# Altium schematic sheet Power_Supply.SchDoc: Power Supply
size A3; Organization: ORGANIZATION; Address1: ADDRESS 1; Address2: ADDRESS 2; Address3: ADDRESS 3; Address4: ADDRESS 4; Revision: 0.0; SheetNumber: 12; SheetTotal: 19; ENG_APP_DATE: --/--/--; DSN_APP_DATE: --/--/--; CHK_APP_DATE: --/--/--
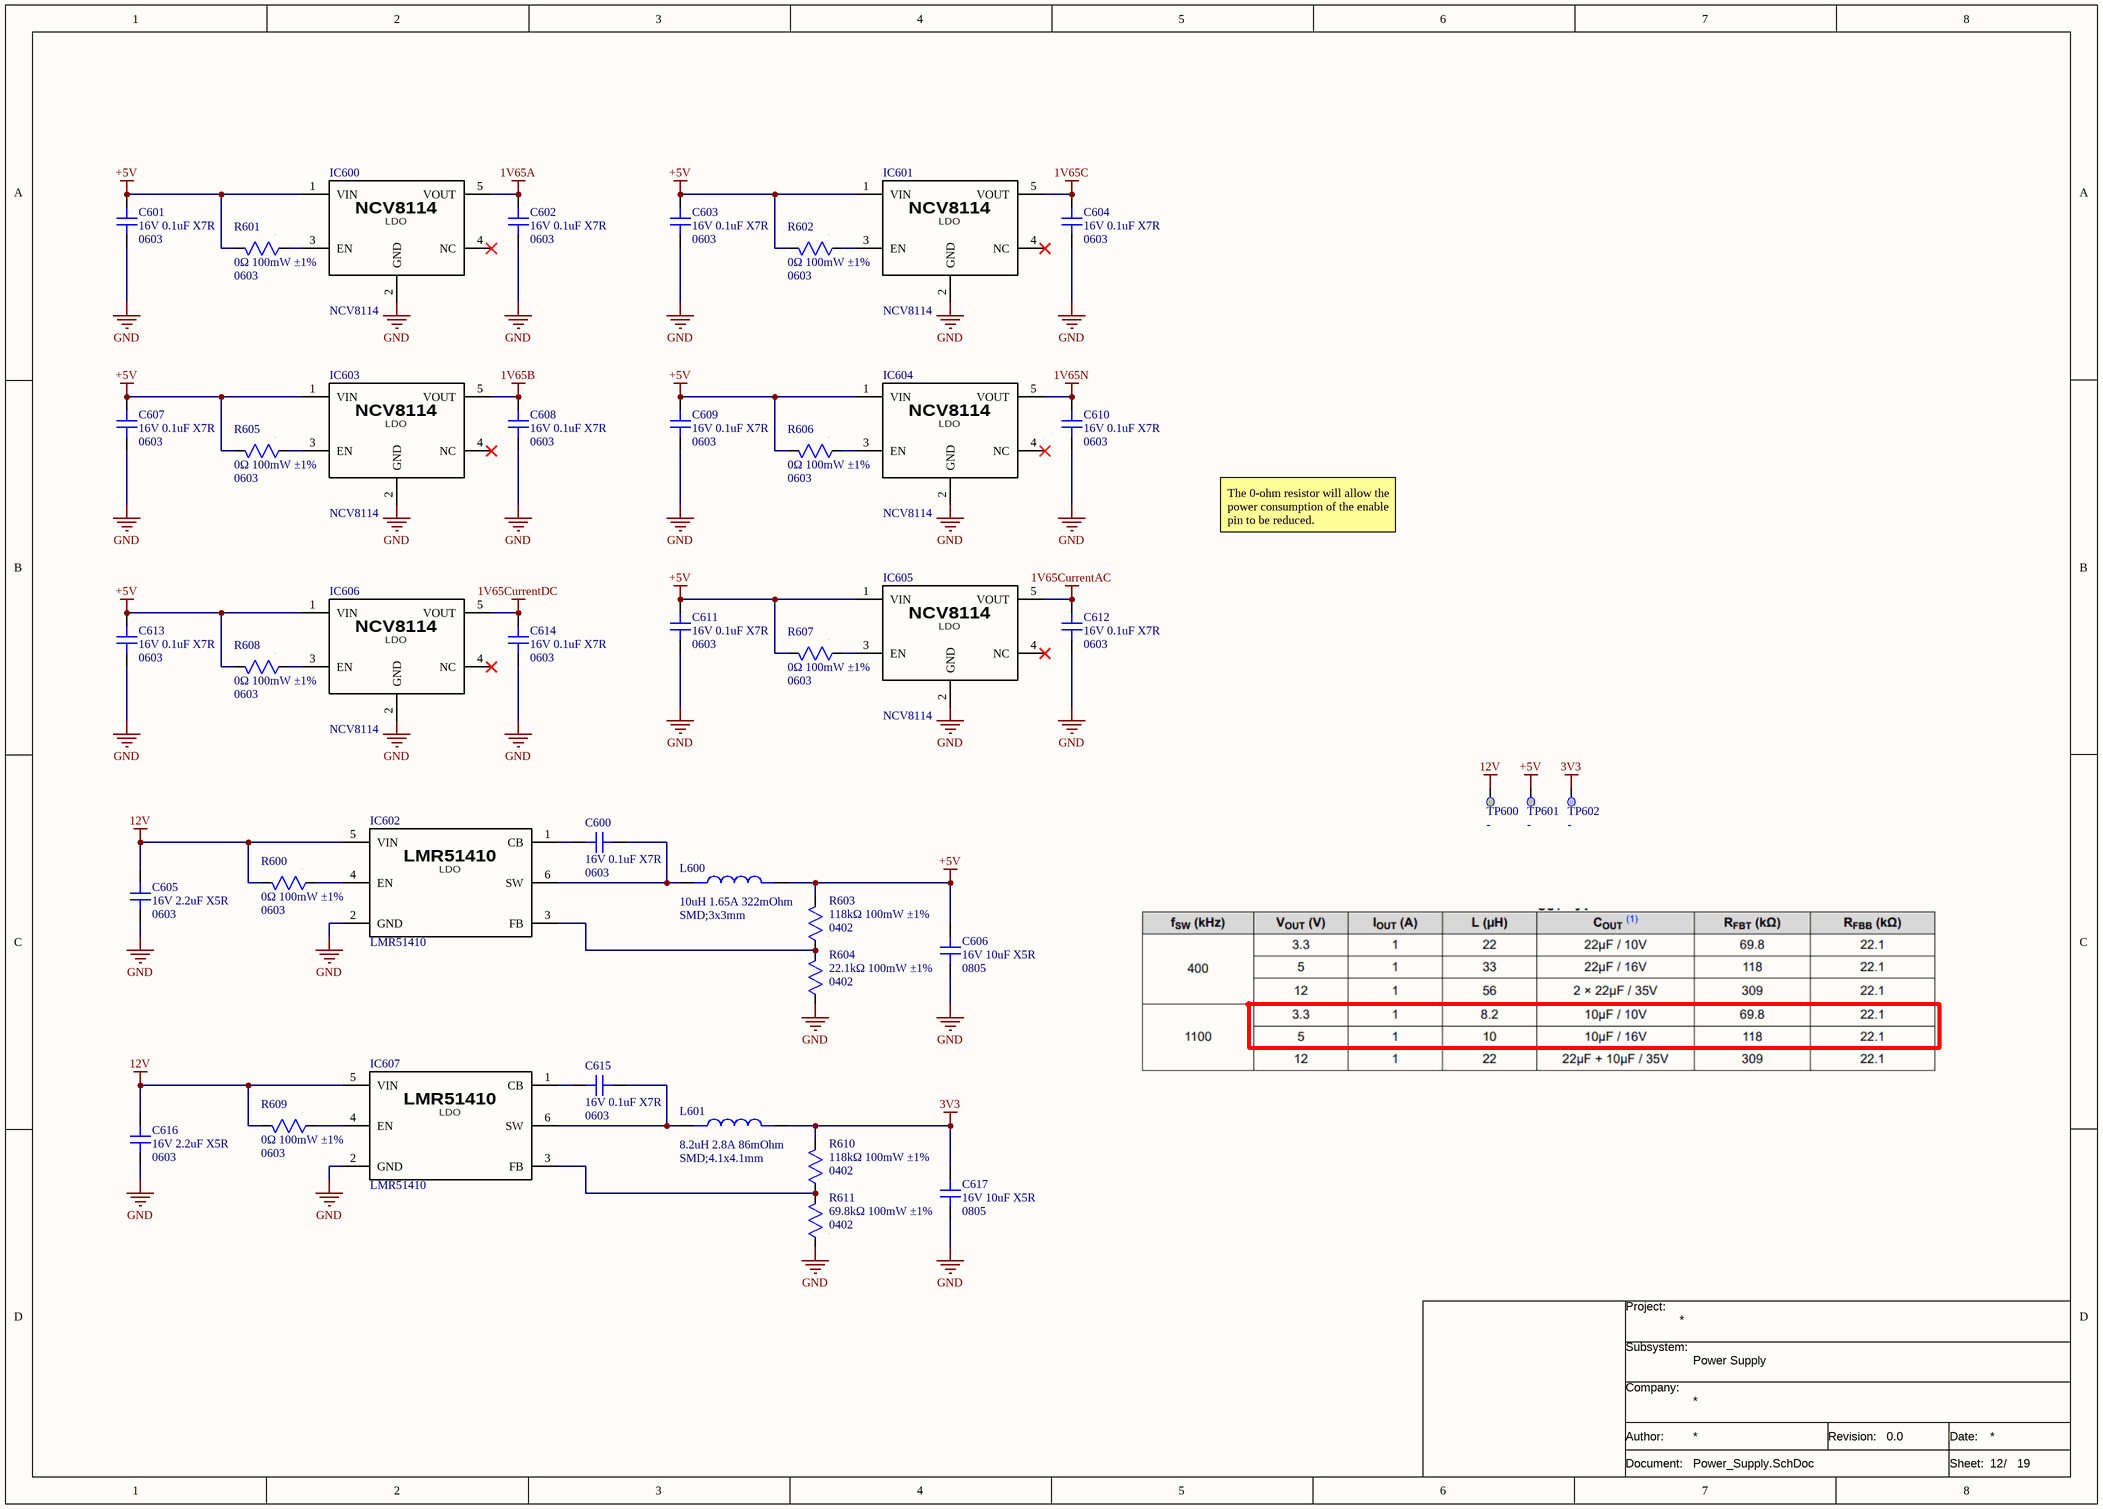
[diagram p0: Power_Supply.SchDoc]

## Parts
C600  value 16V 0.1uF X7R  Package: 0603  [CAP SMD 0603]  (hidden comment: CAP non polarized)
C601  value 16V 0.1uF X7R  Package: 0603  [CAP SMD 0603]  (hidden comment: CAP non polarized)
C602  value 16V 0.1uF X7R  Package: 0603  [CAP SMD 0603]  (hidden comment: CAP non polarized)
C603  value 16V 0.1uF X7R  Package: 0603  [CAP SMD 0603]  (hidden comment: CAP non polarized)
C604  value 16V 0.1uF X7R  Package: 0603  [CAP SMD 0603]  (hidden comment: CAP non polarized)
C605  value 16V 2.2uF X5R  Package: 0603  [CAP SMD 0603]  (hidden comment: CAP non polarized)
C606  value 16V 10uF X5R  Package: 0805  [CAP SMD 0805]  (hidden comment: CAP non polarized)
C607  value 16V 0.1uF X7R  Package: 0603  [CAP SMD 0603]  (hidden comment: CAP non polarized)
C608  value 16V 0.1uF X7R  Package: 0603  [CAP SMD 0603]  (hidden comment: CAP non polarized)
C609  value 16V 0.1uF X7R  Package: 0603  [CAP SMD 0603]  (hidden comment: CAP non polarized)
C610  value 16V 0.1uF X7R  Package: 0603  [CAP SMD 0603]  (hidden comment: CAP non polarized)
C611  value 16V 0.1uF X7R  Package: 0603  [CAP SMD 0603]  (hidden comment: CAP non polarized)
C612  value 16V 0.1uF X7R  Package: 0603  [CAP SMD 0603]  (hidden comment: CAP non polarized)
C613  value 16V 0.1uF X7R  Package: 0603  [CAP SMD 0603]  (hidden comment: CAP non polarized)
C614  value 16V 0.1uF X7R  Package: 0603  [CAP SMD 0603]  (hidden comment: CAP non polarized)
C615  value 16V 0.1uF X7R  Package: 0603  [CAP SMD 0603]  (hidden comment: CAP non polarized)
C616  value 16V 2.2uF X5R  Package: 0603  [CAP SMD 0603]  (hidden comment: CAP non polarized)
C617  value 16V 10uF X5R  Package: 0805  [CAP SMD 0805]  (hidden comment: CAP non polarized)
IC600  NCV8114  [SOT-23-5]
IC601  NCV8114  [SOT-23-5]
IC602  LMR51410  [SOT-23-6]
IC603  NCV8114  [SOT-23-5]
IC604  NCV8114  [SOT-23-5]
IC605  NCV8114  [SOT-23-5]
IC606  NCV8114  [SOT-23-5]
IC607  LMR51410  [SOT-23-6]
L600  value 10uH 1.65A 322mOhm  Package: SMD;3x3mm  [IND SMD 3x3]  (hidden comment: IND)
L601  value 8.2uH 2.8A 86mOhm  Package: SMD;4.1x4.1mm  [IND SMD 4.1x4.1]  (hidden comment: IND)
R600  value 0Ω 100mW ±1%  Package: 0603  [RES SMD 0603]  (hidden comment: RES)
R601  value 0Ω 100mW ±1%  Package: 0603  [RES SMD 0603]  (hidden comment: RES)
R602  value 0Ω 100mW ±1%  Package: 0603  [RES SMD 0603]  (hidden comment: RES)
R603  value 118kΩ 100mW ±1%  Package: 0402  [RES SMD 0402]  (hidden comment: RES)
R604  value 22.1kΩ 100mW ±1%  Package: 0402  [RES SMD 0402]  (hidden comment: RES)
R605  value 0Ω 100mW ±1%  Package: 0603  [RES SMD 0603]  (hidden comment: RES)
R606  value 0Ω 100mW ±1%  Package: 0603  [RES SMD 0603]  (hidden comment: RES)
R607  value 0Ω 100mW ±1%  Package: 0603  [RES SMD 0603]  (hidden comment: RES)
R608  value 0Ω 100mW ±1%  Package: 0603  [RES SMD 0603]  (hidden comment: RES)
R609  value 0Ω 100mW ±1%  Package: 0603  [RES SMD 0603]  (hidden comment: RES)
R610  value 118kΩ 100mW ±1%  Package: 0402  [RES SMD 0402]  (hidden comment: RES)
R611  value 69.8kΩ 100mW ±1%  Package: 0402  [RES SMD 0402]  (hidden comment: RES)
TP600  Test Point  [TP_SMD_1MM]  (value not drawn)  (no BOM)
TP601  Test Point  [TP_SMD_1MM]  (value not drawn)  (no BOM)
TP602  Test Point  [TP_SMD_1MM]  (value not drawn)  (no BOM)

## Nets
1V65A: C602.2 IC600.5(VOUT)
1V65B: C608.2 IC603.5(VOUT)
1V65C: C604.2 IC601.5(VOUT)
1V65CurrentAC: C612.2 IC605.5(VOUT)
1V65CurrentDC: C614.2 IC606.5(VOUT)
1V65N: C610.2 IC604.5(VOUT)
3V3: C617.1 L601.2 R610.2 TP602.1
12V: C605.1 C616.1 IC602.5(VIN) IC607.5(VIN) R600.2 R609.2 TP600.1
+5V: C601.2 C603.2 C606.1 C607.2 C609.2 C611.2 C613.2 IC600.1(VIN) IC601.1(VIN) IC603.1(VIN) IC604.1(VIN) IC605.1(VIN) IC606.1(VIN) L600.2 R601.2 R602.2 R603.2 R605.2 R606.2 R607.2 R608.2 TP601.1
GND: C601.1 C602.1 C603.1 C604.1 C605.2 C606.2 C607.1 C608.1 C609.1 C610.1 C611.1 C612.1 C613.1 C614.1 C616.2 C617.2 IC600.2(GND) IC601.2(GND) IC602.2(GND) IC603.2(GND) IC604.2(GND) IC605.2(GND) IC606.2(GND) IC607.2(GND) R604.1 R611.1
NetC600_1: C600.1 IC602.1(CB)
NetC600_2: C600.2 IC602.6(SW) L600.1
NetC615_1: C615.1 IC607.1(CB)
NetC615_2: C615.2 IC607.6(SW) L601.1
NetIC600_3: IC600.3(EN) R601.1
NetIC601_3: IC601.3(EN) R602.1
NetIC602_3: IC602.3(FB) R603.1 R604.2
NetIC602_4: IC602.4(EN) R600.1
NetIC603_3: IC603.3(EN) R605.1
NetIC604_3: IC604.3(EN) R606.1
NetIC605_3: IC605.3(EN) R607.1
NetIC606_3: IC606.3(EN) R608.1
NetIC607_3: IC607.3(FB) R610.1 R611.2
NetIC607_4: IC607.4(EN) R609.1

Not connected (* = marked no-connect by the designer): IC600 4(NC)*; IC601 4(NC)*; IC603 4(NC)*; IC604 4(NC)*; IC605 4(NC)*; IC606 4(NC)*

## Notes on the sheet
- The 0-ohm resistor will allow the power consumption of the enable pin to be reduced.
- Project:
- Subsystem:
- Company:
- Document:
- Author:
- Revision:
- Date:
- Sheet:
- /
- (in symbol 070-0007) LDO
- (in symbol 070-0009) LDO

## Library data of the parts
C600-C604 C607-C615 = 001-0112: Condensadores de cerámica multicapa (MLCC- SMD/SMT) WCAP-CSGP 0.1uF 0603 10% 16V MLCC; MPN: 885012206046; Manufacturer: Wurth Elektronik; ComponentLink1Description: Datasheet; ComponentLink1URL: https://www.we-online.com/components/products/datasheet/885012206046.pdf; ComponentLink2Description: Distributor Link; ComponentLink2URL: https://www.mouser.es/ProductDetail/Wurth-Elektronik/885012206046?qs=0KOYDY2FL2%252B89gr6HvTBXA%3D%3D; ID: 001-0112; Distributor PN: 710-885012206046; Distributor: Mouser
C605 C616 = 001-0113: Condensadores de cerámica multicapa (MLCC- SMD/SMT) WCAP-CSGP 2.2uF 16V 10%; MPN: 885012106029; Manufacturer: Wurth Elektronik; ComponentLink1Description: Datasheet; ComponentLink1URL: https://www.we-online.com/components/products/datasheet/885012106029.pdf; ComponentLink2Description: Distributor Link; ComponentLink2URL: https://www.mouser.es/ProductDetail/Wurth-Elektronik/885012106029?qs=amGC7iS6iy%252BgG3I4L92Nqg%3D%3D; ID: 001-0113; Distributor PN: 710-885012106029; Distributor: Mouser
C606 C617 = 001-0111: Condensadores de cerámica multicapa (MLCC- SMD/SMT) WCAP-CSGP 10uF 0805 20% 16V MLCC; MPN: 885012107014; Manufacturer: Wurth Elektronik; ComponentLink1Description: Datasheet; ComponentLink1URL: https://www.we-online.com/components/products/datasheet/885012107014.pdf; ComponentLink2Description: Distributor Link; ComponentLink2URL: https://www.mouser.es/ProductDetail/Wurth-Elektronik/885012107014?qs=0KOYDY2FL28i0pwNdARIlg%3D%3D; ID: 001-0111; Distributor PN: 710-885012107014; Distributor: Mouser
IC600 IC601 IC603-IC606 = 070-0009: Reguladores de voltaje LDO 300 MA CMOS LDO, AD OPTIO; MPN: NCV8114ASN165T1G; Manufacturer: onsemi; Value: (1.7/5.5)V-1.65V; ComponentLink1Description: Datasheet; ComponentLink1URL: https://www.onsemi.com/pdf/datasheet/ncv8114-d.pdf; ComponentLink2Description: Distributor Link; ComponentLink2URL: https://www.mouser.es/ProductDetail/onsemi/NCV8114ASN165T1G?qs=PqoDHHvF64%252BWMsY7A2HF3Q%3D%3D; ID: 070-0009; Package: SOT-23-5; Distributor PN: 863-NCV8114ASN165T1G; Distributor: Mouser
IC602 IC607 = 070-0007: Reguladores de tensión de conmutación SIMPLE SWITCHER 4V t o 42V 1A synchronou; MPN: LMR51410YFDBVR; Manufacturer: Texas Instruments; Value: (4/42)V-(0.8/28)V; ComponentLink1Description: Datasheet; ComponentLink1URL: https://www.ti.com/lit/ds/symlink/lmr51410.pdf?ts=1781684561920&ref_url=https%253A%252F%252Fwww.mouser.de%252F; ComponentLink2Description: Distributor Link; ComponentLink2URL: https://www.mouser.es/ProductDetail/Texas-Instruments/LMR51410YFDBVR?qs=i8QVZAFTkqTUiBodeYrDsw%3D%3D; ID: 070-0007; Package: SOT-23-6; Distributor PN: 595-LMR51410YFDBVR; Distributor: Mouser
L600 = 020-0001: Inductores de potencia (SMD) WE-MAPI 10uH 1.2A DCR=322mOhms AEC-Q200; MPN: 74438336100; Manufacturer: Wurth Elektronik; ComponentLink1Description: Datasheet; ComponentLink1URL: https://www.we-online.com/components/products/datasheet/74438336100.pdf; ComponentLink2Description: Distributor Link; ComponentLink2URL: https://www.mouser.es/ProductDetail/Wurth-Elektronik/74438336100?qs=iC14BvcgY%2F3tj5fn6qP7Hg%3D%3D; ID: 020-0001; Distributor PN: 710-74438336100; Distributor: Mouser
L601 = 020-0002: Inductores de potencia (SMD) WE-MAPI 8.2uH 2.8A DCR=86mOhms AEC-Q200; MPN: 74438357082; Manufacturer: Wurth Elektronik; ComponentLink1Description: Datasheet; ComponentLink1URL: https://www.we-online.com/components/products/datasheet/74438357082.pdf; ComponentLink2Description: Distributor Link; ComponentLink2URL: https://www.mouser.es/ProductDetail/Wurth-Elektronik/74438357082?qs=AQlKX63v8RvaY%2FvJVfZzHA%3D%3D; ID: 020-0002; Distributor PN: 710-74438357082; Distributor: Mouser
R600-R602 R605-R609 = 010-0160: Resistores de película gruesa - SMD WRIS-RSKS <0.05 Ohms 0.1 W Jumper 0603 AEC-Q200; MPN: 5,60112116e+11; Manufacturer: Wurth Elektronik; ComponentLink1Description: Datasheet; ComponentLink1URL: https://www.we-online.com/components/products/datasheet/560112116001.pdf; ComponentLink2Description: Distributor Link; ComponentLink2URL: https://www.mouser.es/ProductDetail/Wurth-Elektronik/560112116001?qs=mELouGlnn3dlnHYj7TecuA%3D%3D; ID: 010-0160; Distributor PN: 710-560112116001; Distributor: Mouser
R603 R610 = 010-0156: Resistores de película gruesa - SMD WRIS-RSKS 118 kOhms 1 % 0.1 W 0402 AEC-Q200; MPN: 560112110142; Manufacturer: Wurth Elektronik; ComponentLink1Description: Datasheet; ComponentLink1URL: https://www.we-online.com/components/products/datasheet/560112110142.pdf; ComponentLink2Description: Distributor Link; ComponentLink2URL: https://www.mouser.es/ProductDetail/Wurth-Elektronik/560112110142?qs=mELouGlnn3daEwPMtfpdeg%3D%3D; ID: 010-0156; Distributor PN: 710-560112110142; Distributor: Mouser
R604 = 010-0157: Resistores de película gruesa - SMD WRIS-RSKS 22.1 kOhms 1 % 0.1 W 0402 AEC-Q200; MPN: 560112110099; Manufacturer: Wurth Elektronik; ComponentLink1Description: Datasheet; ComponentLink1URL: https://www.we-online.com/components/products/datasheet/560112110099.pdf; ComponentLink2Description: Distributor Link; ComponentLink2URL: https://www.mouser.es/ProductDetail/Wurth-Elektronik/560112110099?qs=mELouGlnn3eF8MLEVMJrCw%3D%3D; ID: 010-0157; Distributor PN: 710-560112110099; Distributor: Mouser
R611 = 010-0158: Resistores de película gruesa - SMD 1/10 Watt 69.8Kohms 1%; MPN: CRCW040269K8FKED; Manufacturer: Vishay; ComponentLink1Description: Datasheet; ComponentLink1URL: https://www.vishay.com/docs/20035/dcrcwe3.pdf; ComponentLink2Description: Distributor Link; ComponentLink2URL: https://www.mouser.es/ProductDetail/Vishay/CRCW040269K8FKED?qs=sGAEpiMZZMtlubZbdhIBICni6BQV4SfY1e7wNtp2Znw%3D; ID: 010-0158; Distributor PN: 71-CRCW0402-69.8K-E3; Distributor: Mouser
TP600-TP602 = 110-0007: ComponentLink1URL: -; ComponentLink1Description: Datasheet; ComponentLink1URL: *; ComponentLink2Description: Distributor Link; ComponentLink2URL: -; ID: 110-0007; Value: -; Package: -; MPN: -; Manufacturer: -; Distributor PN: -; Distributor: -